# EasyEDA Pro project Modular End Effector.eprj

# Schematic Schematic1
Board Name: MainBoard; Create Date: 2026-03-02; Page Name: P1; Project Name: Modular End Effector; Schematic Name: Schematic1; Update Date: 2026-03-23; Company: EasyEDA.com; Page Size: A4; Version: V1.0
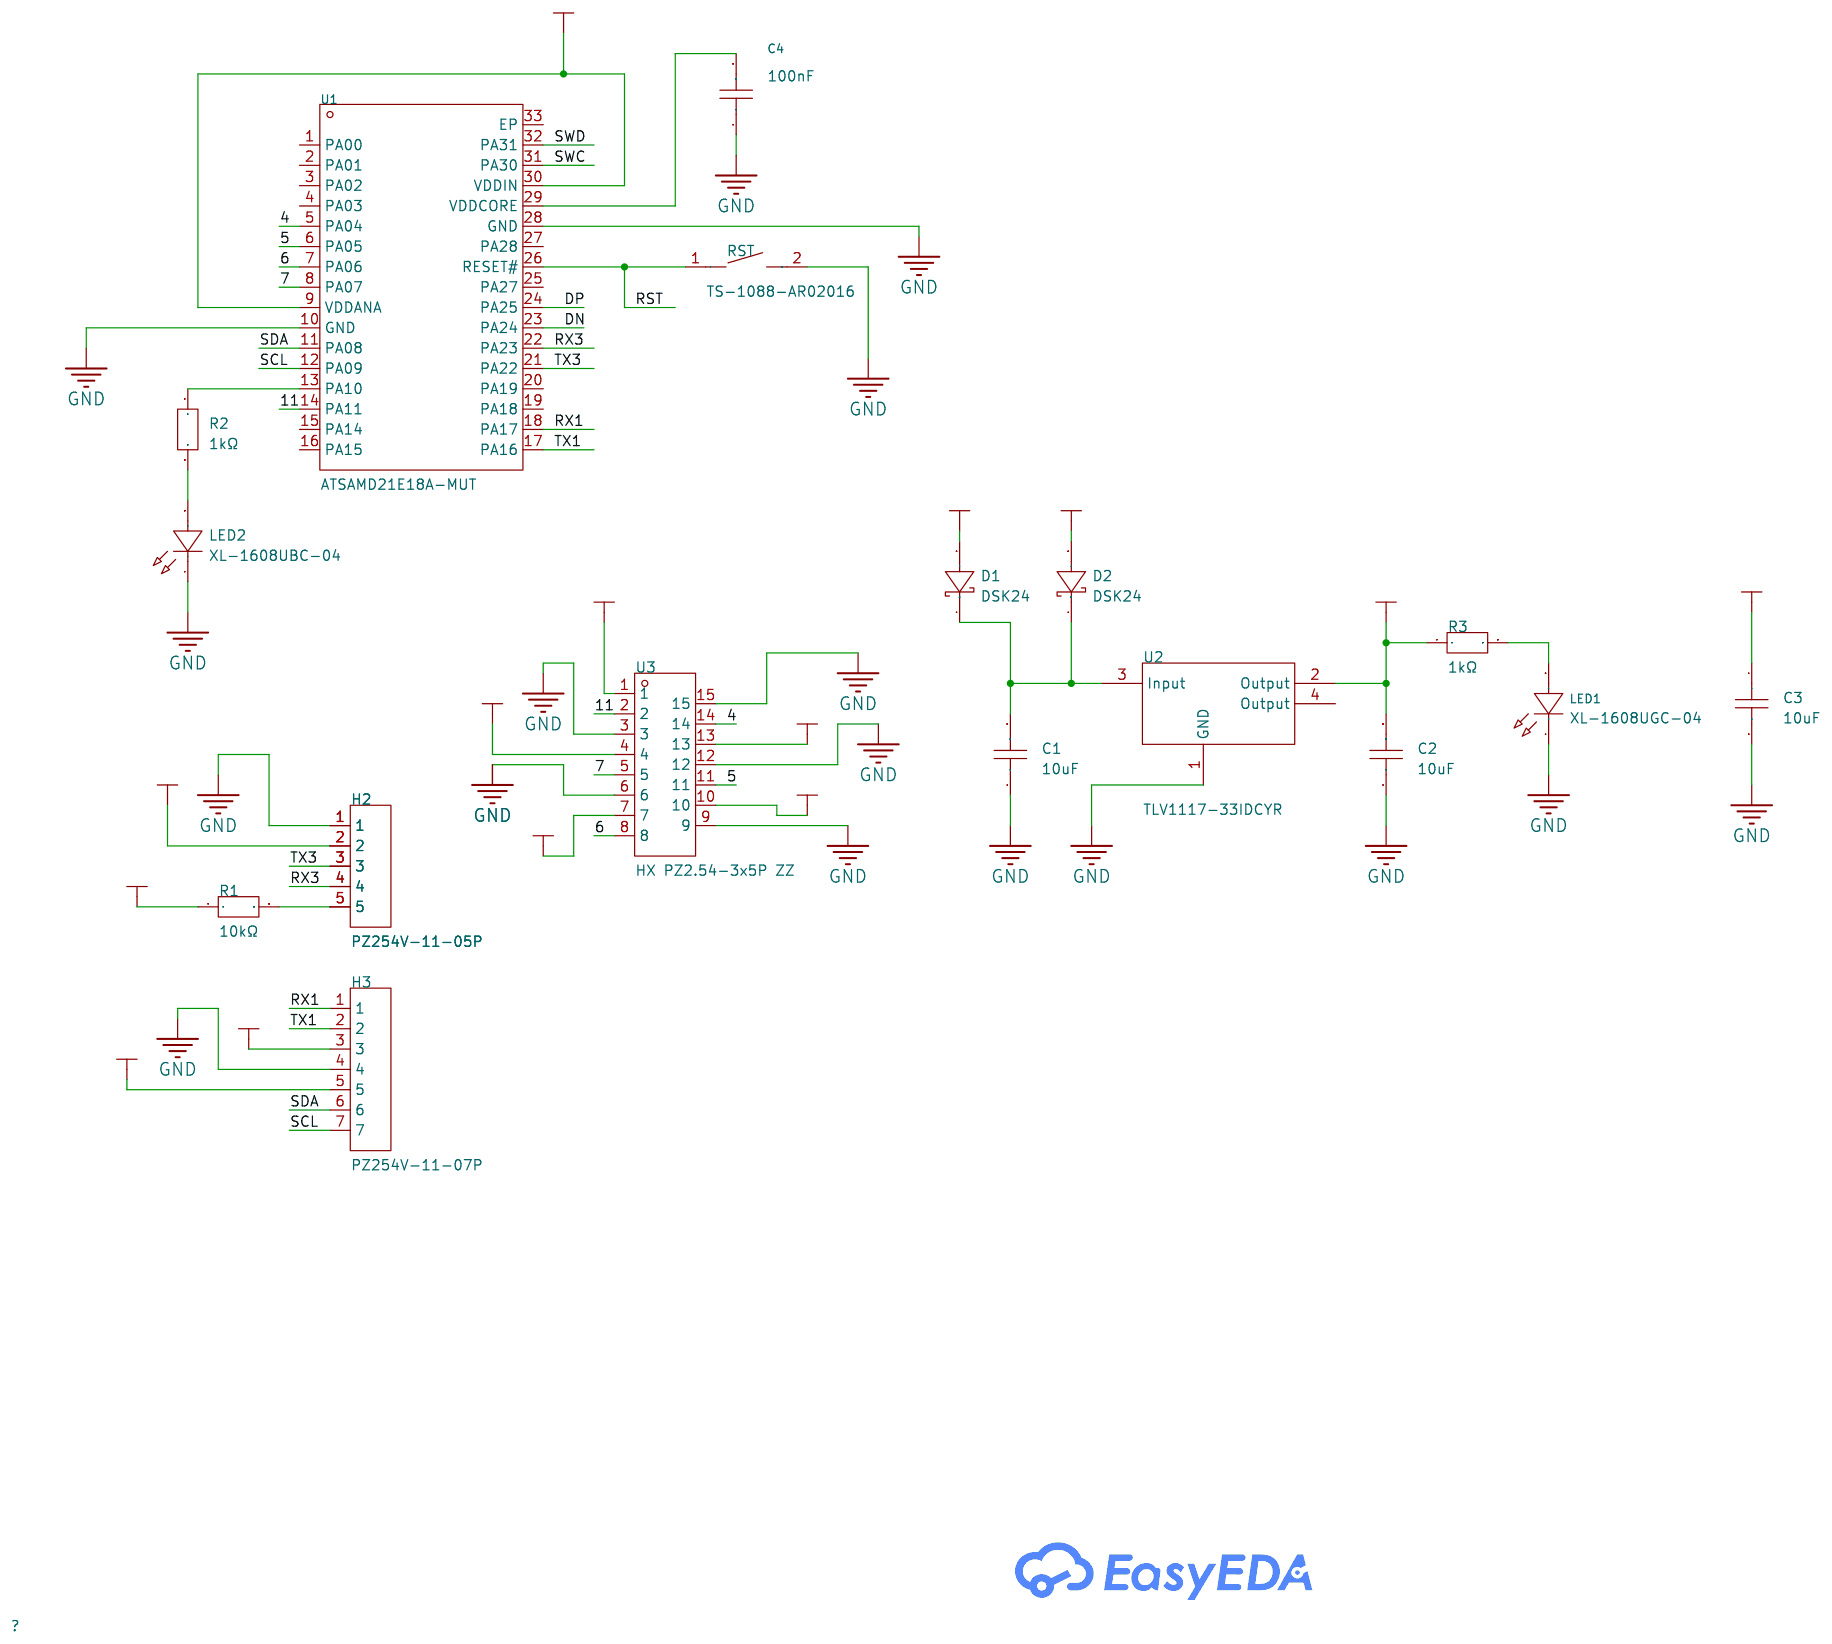
[diagram p0: schematic sheet]

## Parts
C1  10uF  [C0805]
C2  10uF  [C0805]
C3  10uF  [C0805]
C4  100nF  [C0402]
D1  DSK24  [SOD-123FL_L2.7-W1.8-LS3.8-RD]
D2  DSK24  [SOD-123FL_L2.7-W1.8-LS3.8-RD]
H2  PZ254V-11-05P  [HDR-TH_5P-P2.54-V-M]  (no BOM)
H3  PZ254V-11-07P  [HDR-TH_7P-P2.54-V-M]  (no BOM)
LED1  XL-1608UGC-04  [LED0603-RD_GREEN]
LED2  XL-1608UBC-04  [LED0603-RD_BLUE]
R1  10kΩ  [R0402]
R2  1kΩ  [R0402]
R3  1kΩ  [R0402]
RST  TS-1088-AR02016  [SW-SMD_L3.9-W3.0-P4.45]
U1  ATSAMD21E18A-MUT  [QFN-32_L5.0-W5.0-P0.50-TL-EP3.6]
U2  TLV1117-33IDCYR  [SOT-223-4_L6.5-W3.5-P2.30-LS7.0-BR]
U3  HX PZ2.54-3x5P ZZ  [HDR-TH_15P-P2.54-V-M-R3-C5-S7.5]  (no BOM)

## Library data of the parts
C1 = CGA0805X5R106K160MT: LCSC Part Name: 10uF ±10% 16V; Supplier Part: C6119886; Manufacturer: HRE(芯声); Supplier Footprint: 0805; JLCPCB Part Class: Extended Part; Datasheet: https://item.szlcsc.com/datasheet/CGA0805X5R106K160MT/7062592.html; Supplier: LCSC; Tolerance: ±10%; Voltage Rating: 16V; Temperature Coefficient: X5R
C2 C3 = CS2012X7R106M100NRE: LCSC Part Name: 10uF ±20% 10V; Supplier Part: C5189822; Manufacturer: SAMWHA(三和); Supplier Footprint: 0805; JLCPCB Part Class: Extended Part; Datasheet: https://item.szlcsc.com/datasheet/CS2012X7R106M100NRE/5869643.html; Supplier: LCSC; Tolerance: ±20%; Voltage Rating: 10V; Temperature Coefficient: X7R
C4 = CC0402KRX7R6BB104: LCSC Part Name: 100nF ±10% 10V; Supplier Part: C309458; Manufacturer: YAGEO(国巨); Supplier Footprint: 0402; JLCPCB Part Class: Extended Part; Datasheet: https://item.szlcsc.com/datasheet/CC0402KRX7R6BB104/293074.html; Supplier: LCSC; Tolerance: ±10%; Voltage Rating: 10V; Temperature Coefficient: X7R
D1 D2 = DSK24_C908229: LCSC Part Name: 电压:40V 电流:2A; Supplier Part: C908229; Manufacturer: FUXINSEMI(富芯森美); Supplier Footprint: SOD-123; JLCPCB Part Class: Extended Part; Datasheet: https://atta.szlcsc.com/upload/public/pdf/source/20201027/C908229_4A8ECB1BD88877D27DF9B2F604A33773.pdf; Supplier: LCSC; Forward Voltage (Vf@If): 550mV@2A; Reverse Voltage (Vr): 40V; Rectified Current: 2A; Reverse Leakage Current (Ir): 500uA
H2 = PZ254V-11-05P: LCSC Part Name: 1x5P 间距:2.54mm 方针 直插; Supplier Part: C492404; Manufacturer: XFCN(兴飞); Supplier Footprint: 插件,P=2.54mm; JLCPCB Part Class: Extended Part; Datasheet: https://item.szlcsc.com/datasheet/PZ254V-11-05P/502960.html; Supplier: LCSC; Pin Structure: 1x5P; Pitch: 2.54mm; Circluar Pins/Square Pins: Pin Header; Mounting Type: Through Hole; Number of Rows: 1; Number of Pins: 5P; Current Rating: 3A; Voltage Rating (Max): 250V; Length of Mating Pin: 6mm; Insulation Height: 2.5mm; Length of End Connection Pin: 3mm; Contact Material: Brass; Operating Temperature: -40℃~+105℃; Color: Black
H3 = PZ254V-11-07P: LCSC Part Name: 1x7P 间距:2.54mm 方针 直插; Supplier Part: C492406; Manufacturer: XFCN(兴飞); Supplier Footprint: 插件,P=2.54mm; JLCPCB Part Class: Extended Part; Datasheet: https://item.szlcsc.com/datasheet/PZ254V-11-07P/502962.html; Supplier: LCSC; Pin Structure: 1x7P; Pitch: 2.54mm; Circluar Pins/Square Pins: Pin Header; Mounting Type: Through Hole; Number of Rows: 1; Number of Pins: 7P; Current Rating: 3A; Voltage Rating (Max): 250V; Length of Mating Pin: 6mm; Insulation Height: 2.5mm; Length of End Connection Pin: 3mm; Contact Material: Brass; Operating Temperature: -40℃~+105℃; Color: Black
LED1 = XL-1608UGC-04: LCSC Part Name: 0603翠绿贴片式发光二极管; Supplier Part: C965804; Manufacturer: XINGLIGHT(成兴光); Supplier Footprint: 0603; JLCPCB Part Class: Extended Part; Datasheet: https://item.szlcsc.com/datasheet/XL-1608UGC-04/1051413.html; Supplier: LCSC; Illumination Color: Emerald Green; Voltage - Forward(Vf): 3.3V; Power(Watts): 70mW; Forward Current: 20mA; Wavelength - Dominant: 515nm~535nm; Peak Wavelength: 525nm; Diode Configuration: Discrete Diode; Lens Color: Water Clear; Luminous Intensity: 810mcd; Viewing Angle: 120°; Mounting Style: Top-mount; Operating Temperature: -40℃~+85℃
LED2 = XL-1608UBC-04: LCSC Part Name: 0603蓝色贴片式发光二极管; Supplier Part: C965807; Manufacturer: XINGLIGHT(成兴光); Supplier Footprint: 0603; JLCPCB Part Class: Extended Part; Datasheet: https://item.szlcsc.com/datasheet/XL-1608UBC-04/1051416.html; Supplier: LCSC; Illumination Color: Blue; Voltage - Forward(Vf): 3.3V; Power(Watts): 70mW; Forward Current: 20mA; Wavelength - Dominant: 455nm~475nm; Peak Wavelength: 470nm; Lens Color: Water Clear; Luminous Intensity: 300mcd; Viewing Angle: 120°; Mounting Style: op View Mount
R1 = FRC0402J103 TS: LCSC Part Name: 10kΩ ±5% 62.5mW 厚膜电阻; Supplier Part: C2906885; Manufacturer: FOJAN(富捷); Supplier Footprint: 0402; JLCPCB Part Class: Extended Part; Supplier: LCSC; Type: Thick Film Resistor; Tolerance: ±5%; Power(Watts): 62.5mW; Voltage-Supply(Max): 50V; Temperature Coefficient: ±100ppm/℃; Operating Temperature: -55℃~+155℃
R2 R3 = FRC0402F1001TS: LCSC Part Name: 1kΩ ±1% 62.5mW 厚膜电阻; Supplier Part: C2906864; Manufacturer: FOJAN(富捷); Supplier Footprint: 0402; JLCPCB Part Class: Extended Part; Supplier: LCSC; Type: Thick Film Resistor; Tolerance: ±1%; Power(Watts): 62.5mW; Voltage-Supply(Max): 50V; Temperature Coefficient: ±100ppm/℃; Operating Temperature: -55℃~+155℃
RST = TS-1088-AR02016: LCSC Part Name: 4*3*2mm 立贴 轻触开关; Supplier Part: C720477; Manufacturer: XUNPU(讯普); Supplier Footprint: SMD,4x3mm; JLCPCB Part Class: Basic Part; Datasheet: https://item.szlcsc.com/datasheet/TS-1088-AR02016/763484.html; Supplier: LCSC; Circuit: SPST; Actuator Style: Round Button; Operating Force: 1.6N; Mounting Type: Surface Mount,Vertical; Length: 4mm; Width: 3mm; Switch Height: 2mm; with Bracket: Without Bracket; Contact Current: 50mA; Voltage Rating: 12V; Actuator/Cap Color: Black; Termination Style: SMD(SMT) Tab; Life: 100,000 Cycles; Operating Temperature: -30℃~+80℃
U1 = ATSAMD21E18A-MUT: LCSC Part Name: 低功耗、带先进模拟电路和PWM的32位Cortex-M0+微控制器; Supplier Part: C2052801; Manufacturer: MICROCHIP(美国微芯); Supplier Footprint: QFN-32-EP(5x5); JLCPCB Part Class: Extended Part; Datasheet: https://item.szlcsc.com/datasheet/ATSAMD21E18A-MUT/2144370.html; Supplier: LCSC; CPU Core: ARM Cortex-M0+; CPU Maximum Speed: 48MHz; Core Size: 32 Bit; Program Storage Size: 256KB; Program Memory Type: FLASH; RAM Size: 32KB; Number of I/O: 26; ADC (Bit): 12bit; DAC (Bit): 10bit; Oscillator Type: Built-in; Voltage - Supply: 1.62V~3.6V; Operating Temperature: -40℃~+85℃
U2 = TLV1117-33IDCYR_C37359: LCSC Part Name: 800mA 15V 线性稳压器; Supplier Part: C37359; Manufacturer: TI(德州仪器); Supplier Footprint: SOT-223-4; JLCPCB Part Class: Extended Part; Datasheet: https://www.ti.com/cn/lit/gpn/tlv1117; Supplier: LCSC; Output Type: Fixed; Maximum Input Voltage: 15V; Output Voltage: 3.3V; Output Current: 800mA; Power Supply Rejection Ratio (PSRR): 75dB@(120Hz); Dropout Voltage: 1.3V@(800mA); Feature: ESD Protection；Overcurrent Protection(OCP)；With ability; Operating Temperature: -40℃~+125℃; Output Polarity: Positive electrode; Number of Outputs: 1
U3 = HX PZ2.54-3x5P ZZ: LCSC Part Name: 3x5P 间距:2.54mm 方针 直插; Supplier Part: C32713292; Manufacturer: hanxia(韩下); Supplier Footprint: 插件,P=2.54mm; JLCPCB Part Class: Extended Part; Datasheet: https://item.szlcsc.com/datasheet/HX%2520PZ2.54-3x5P%2520ZZ/34444572.html; Supplier: LCSC; Pin Structure: 3x5P; Pitch: 2.54mm; Row Spacing: 2.54mm; Circluar Pins/Square Pins: Pin Header; Mounting Type: Through Hole; Number of Rows: 3; Number of Pins: 15P; Current Rating: 3A; Voltage Rating (Max): 1kV; Length of Mating Pin: 6mm; Insulation Height: 2.5mm; Length of End Connection Pin: 3mm; Contact Material: Brass; Contact Plating: Gold; Operating Temperature: -40℃~+105℃; Color: Black

## Nets
+3.3V: C2.2 C3.1 H3.5 R1.1 R3.1 U1.9(VDDANA) U1.30(VDDIN) U2.2(Output)
+7.4V: D1.2(A) H2.2 H3.3 U3.1 U3.4 U3.7 U3.10 U3.13
GND: C1.1 C2.1 C3.2 C4.1 H2.1 H3.4 LED1.1(K) LED2.1(K) RST.2 U1.10(GND) U1.28(GND) U2.1(GND) U3.3 U3.6 U3.9 U3.12 U3.15
VBUS: D2.2(A)
4: U1.5(PA04) U3.14
5: U1.6(PA05) U3.11
6: U1.7(PA06) U3.8
7: U1.8(PA07) U3.5
11: U1.14(PA11) U3.2
DN: U1.23(PA24)
DP: U1.24(PA25)
RST: RST.1 U1.26(RESET#)
RX1: H3.1 U1.18(PA17)
RX3: H2.4 U1.22(PA23)
SCL: H3.7 U1.12(PA09)
SDA: H3.6 U1.11(PA08)
SWC: U1.31(PA30)
SWD: U1.32(PA31)
TX1: H3.2 U1.17(PA16)
TX3: H2.3 U1.21(PA22)
$1N1936: C1.2 D1.1(C) D2.1(C) U2.3(Input)
$1N2134: C4.2 U1.29(VDDCORE)
$1N2737: H2.5 R1.2
$1N3455: R2.1 U1.13(PA10)
Net-(LED1-2): LED1.2(A) R3.2
Net-(LED2-2): LED2.2(A) R2.2

Not connected (* = marked no-connect by the designer): U1 1(PA00) 2(PA01) 3(PA02) 4(PA03) 15(PA14) 16(PA15) 19(PA18) 20(PA19) 25(PA27) 27(PA28) 33(EP); U2 4(Output)

# Schematic Schematic2
Board Name: PogoBoard; Create Date: 2026-03-04; Page Name: P1; Project Name: Modular End Effector; Schematic Name: Schematic2; Update Date: 2026-03-04; Company: EasyEDA.com; Page Size: A4; Version: V1.0
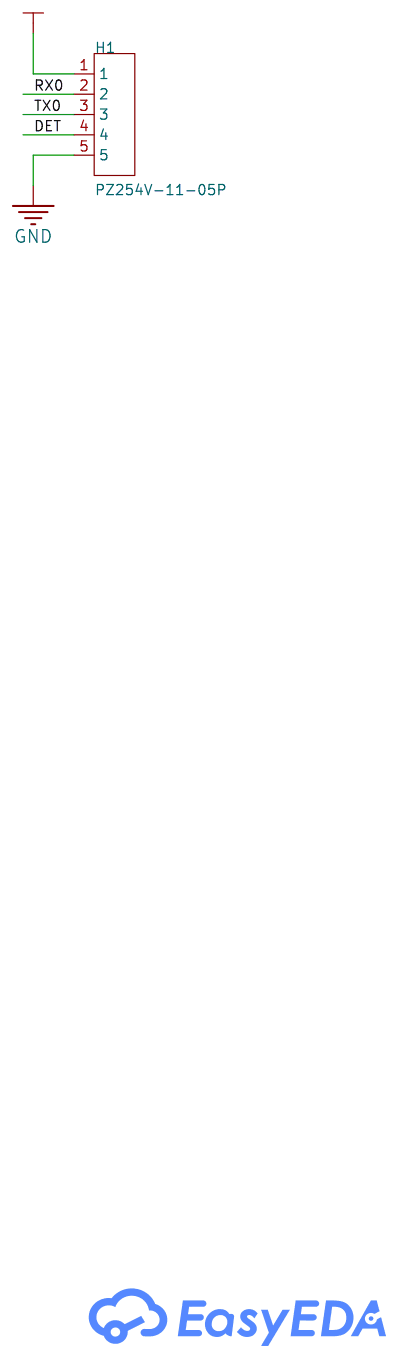
[diagram p1: schematic sheet]

## Parts
H1  PZ254V-11-05P  [HDR-TH_5P-P2.54-V-M]  (no BOM)

## Library data of the parts
H1 = PZ254V-11-05P: LCSC Part Name: 1x5P 间距:2.54mm 方针 直插; Supplier Part: C492404; Manufacturer: XFCN(兴飞); Supplier Footprint: 插件,P=2.54mm; JLCPCB Part Class: Extended Part; Datasheet: https://item.szlcsc.com/datasheet/PZ254V-11-05P/502960.html; Supplier: LCSC; Pin Structure: 1x5P; Pitch: 2.54mm; Circluar Pins/Square Pins: Pin Header; Mounting Type: Through Hole; Number of Rows: 1; Number of Pins: 5P; Current Rating: 3A; Voltage Rating (Max): 250V; Length of Mating Pin: 6mm; Insulation Height: 2.5mm; Length of End Connection Pin: 3mm; Contact Material: Brass; Operating Temperature: -40℃~+105℃; Color: Black

## Nets
+7.4V: H1.1
GND: H1.5
DET: H1.4
RX0: H1.2
TX0: H1.3

# Schematic Schematic3
Board Name: FlashingBoard; Create Date: 2026-03-26; Page Name: P1; Project Name: Modular End Effector; Schematic Name: Schematic3; Update Date: 2026-03-26; Company: EasyEDA.com; Page Size: A4; Version: V1.0
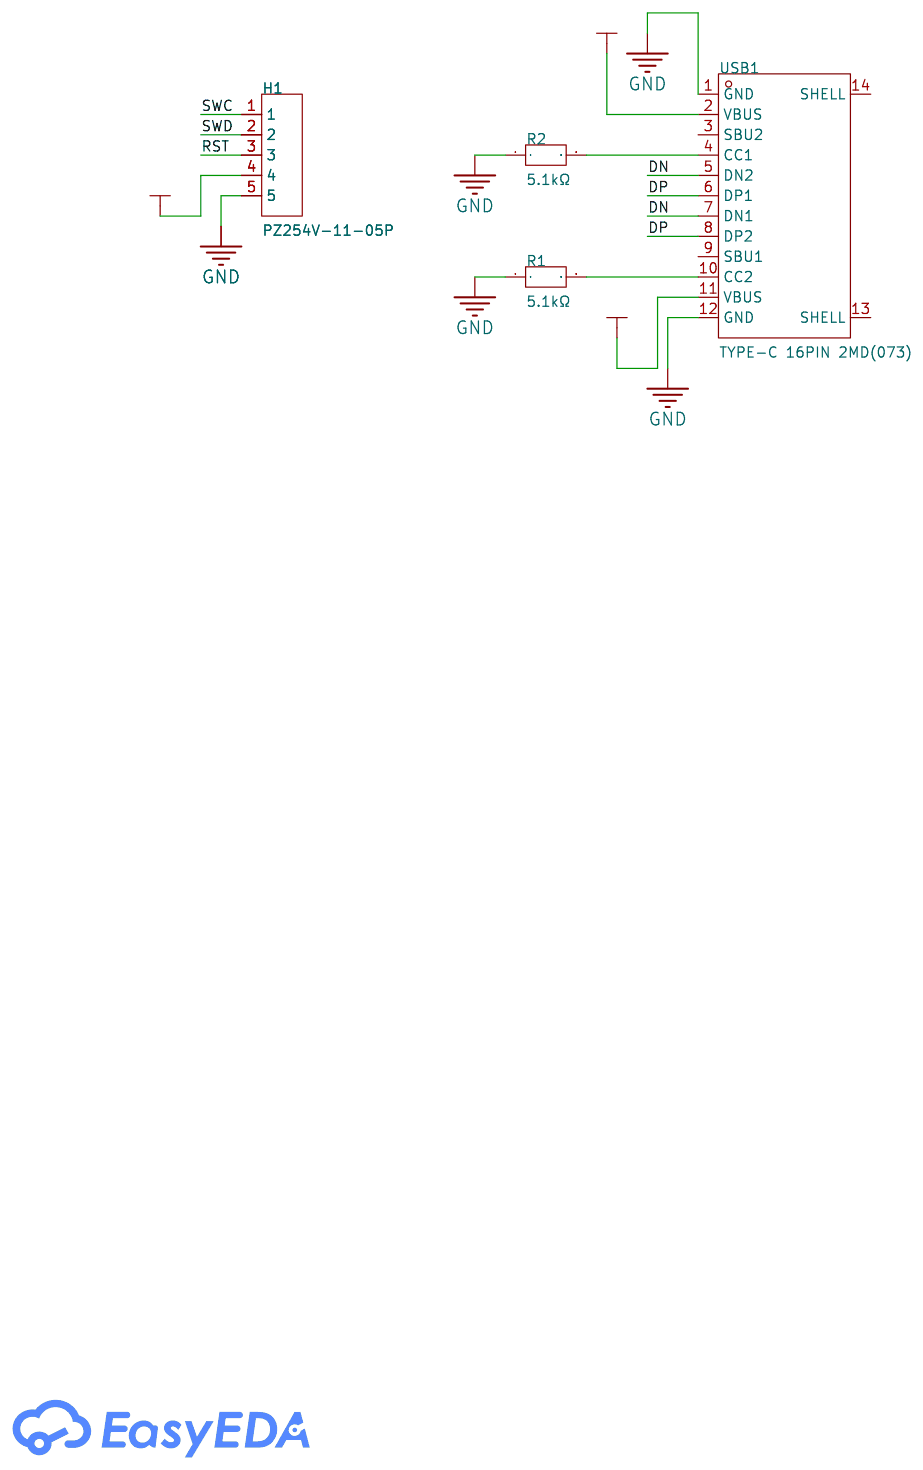
[diagram p2: schematic sheet]

## Parts
H1  PZ254V-11-05P  [HDR-TH_5P-P2.54-V-M]  (no BOM)
R1  5.1kΩ  [R0402]
R2  5.1kΩ  [R0402]
USB1  TYPE-C 16PIN 2MD(073)  [USB-C-SMD_TYPE-C-6PIN-2MD-073]

## Library data of the parts
H1 = PZ254V-11-05P: LCSC Part Name: 1x5P 间距:2.54mm 方针 直插; Supplier Part: C492404; Manufacturer: XFCN(兴飞); Supplier Footprint: 插件,P=2.54mm; JLCPCB Part Class: Extended Part; Datasheet: https://item.szlcsc.com/datasheet/PZ254V-11-05P/502960.html; Supplier: LCSC; Pin Structure: 1x5P; Pitch: 2.54mm; Circluar Pins/Square Pins: Pin Header; Mounting Type: Through Hole; Number of Rows: 1; Number of Pins: 5P; Current Rating: 3A; Voltage Rating (Max): 250V; Length of Mating Pin: 6mm; Insulation Height: 2.5mm; Length of End Connection Pin: 3mm; Contact Material: Brass; Operating Temperature: -40℃~+105℃; Color: Black
R1 R2 = FRC0402F5101TS: LCSC Part Name: 5.1kΩ ±1% 62.5mW 厚膜电阻; Supplier Part: C2906874; Manufacturer: FOJAN(富捷); Supplier Footprint: 0402; JLCPCB Part Class: Extended Part; Supplier: LCSC; Type: Thick Film Resistor; Tolerance: ±1%; Power(Watts): 62.5mW; Voltage-Supply(Max): 50V; Temperature Coefficient: ±100ppm/℃; Operating Temperature: -55℃~+155℃
USB1 = TYPE-C 16PIN 2MD(073): LCSC Part Name: 16P卧贴母座; Supplier Part: C2765186; Manufacturer: SHOU HAN(首韩); Supplier Footprint: SMD; JLCPCB Part Class: Extended Part; Datasheet: https://item.szlcsc.com/datasheet/TYPE-C%252016PIN%25202MD(073)/2901843.html; Supplier: LCSC; Connector Type: Type-C; Gender: Female; Mounting Type: Surface Mount, Right Angle; Number of Contacts: 16P; Number of Ports: 1; Current Rating-Power: 3A; Voltage Rating: 5V; Connect-Disconnect Life: 5,000 times; Detection color: Black; Operating Temperature: -25℃~+85℃

## Nets
+3.3V: H1.4
GND: H1.5 R1.1 R2.1 USB1.1(GND) USB1.12(GND)
VBUS: USB1.2(VBUS) USB1.11(VBUS)
DN: USB1.5(DN2) USB1.7(DN1)
DP: USB1.6(DP1) USB1.8(DP2)
RST: H1.3
SWC: H1.1
SWD: H1.2
$1N451: R2.2 USB1.4(CC1)
$1N455: R1.2 USB1.10(CC2)

Not connected (* = marked no-connect by the designer): USB1 3(SBU2) 9(SBU1) 13(SHELL) 14(SHELL)

# Board PCB1
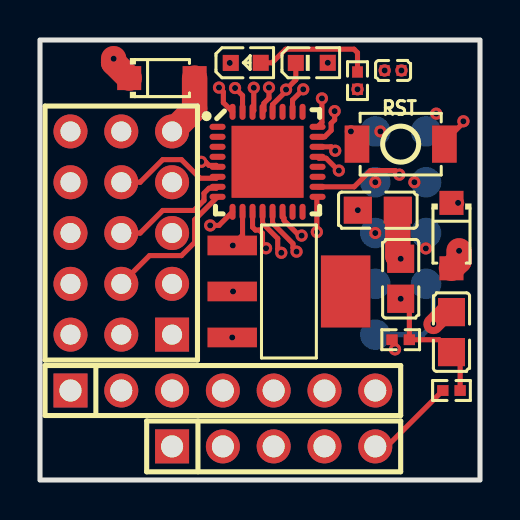
[diagram p3: board, top side]
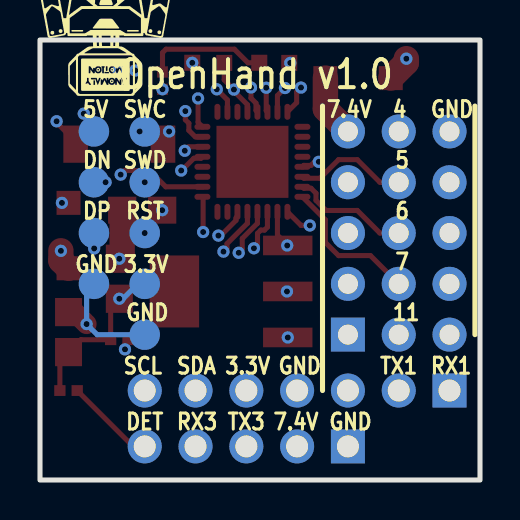
[diagram p4: board, bottom side, seen from below]

Outline 22 x 22 mm; copper layers: Top Layer, Inner1, Inner2, Inner3, Inner4, Bottom Layer. Coordinates in mm from the lower left corner of the outline.
Outline path: rectangle 0,22 22,0
Stack: Top Layer 0.035mm Outer layer thickness 1oz / Dielectric1 0.0994mm 3313 RC57% 4.2mil / Inner1 0.0152mm Inner layer thickness / Dielectric2 0.55mm 0.55mm H/H No copper / Inner2 0.0152mm Inner layer thickness / Dielectric3 0.1088mm 2116 RC54% 4.9mil / Inner3 0.0152mm Inner layer thickness / Dielectric4 0.55mm 0.55mm H/H No copper / Inner4 0.0152mm Inner layer thickness / Dielectric5 0.0994mm 3313 RC57% 4.2mil / Bottom Layer 0.035mm Outer layer thickness 1oz

## Design rules (mm)
template: Custom Config
spacing copperThickness1oz (default): track to track 0.102, other pairs 0.152 to 0.3
spacing copperThickness2oz: track to track 0.203, other pairs 0.152 to 0.3
track width copperThickness1oz (default): min 0.127, default 0.254, max 2.54
track width copperThickness2oz: min 0.203, default 0.254, max 2.54
differential pair differentialPair (default): width min 0.127, default 0.254, max 2.54; gap min 0.152, default 0.152
via viaSize (default): diameter min 0.5, default 0.61, max 10; hole min 0.3, default 0.305, max 6.3

## Placement (name value [footprint] x y rotation side)
C1  10uF  [C0805]  16.89 13.49 180 top
C2  10uF  [C0805]  18.03 10.06 270 top
C3  10uF  [C0805]  20.57 7.39 90 top
C4  100nF  [C0402]  17.65 20.48 0 top
D1  DSK24  [SOD-123FL_L2.7-W1.8-LS3.8-RD]  6.1 20.09 0 top
D2  DSK24  [SOD-123FL_L2.7-W1.8-LS3.8-RD]  20.57 12.22 270 top
H2  PZ254V-11-05P  [HDR-TH_5P-P2.54-V-M]  11.68 1.68 0 top
H3  PZ254V-11-07P  [HDR-TH_7P-P2.54-V-M]  9.14 4.47 0 top
NOREF  -  [Pad_e8208]  16.76 12.35 0 top
NOREF#2  -  [Pad_e8213]  16.76 9.81 0 top
NOREF#3  -  [Pad_e8214]  16.76 7.27 0 top
NOREF#4  -  [Pad_e8199]  19.3 14.89 0 top
NOREF#5  -  [Pad_e8205]  19.3 12.35 0 top
NOREF#6  -  [Pad_e8209]  19.3 9.81 0 top
NOREF#7  -  [Pad_e8201]  16.76 17.43 0 top
NOREF#8  -  [Pad_e8197]  19.3 17.43 0 top
NOREF#9  -  [Pad_e8202]  16.76 14.89 0 top
PA10  XL-1608UBC-04  [LED0603-RD_BLUE]  10.29 20.86 0 top
PWR  XL-1608UGC-04  [LED0603-RD_GREEN]  13.59 20.86 0 top
R1  10kΩ  [R0402]  20.57 4.47 180 top
R2  1kΩ  [R0402]  15.88 19.97 90 top
R3  1kΩ  [R0402]  18.03 7.01 180 top
RST  TS-1088-AR02016  [SW-SMD_L3.9-W3.0-P4.45]  18.03 16.79 0 top
U1  ATSAMD21E18A-MUT  [QFN-32_L5.0-W5.0-P0.50-TL-EP3.6]  11.38 15.91 0 top
U2  TLV1117-33IDCYR  [SOT-223-4_L6.5-W3.5-P2.30-LS7.0-BR]  12.45 9.43 180 top
U3  HX PZ2.54-3x5P ZZ  [HDR-TH_15P-P2.54-V-M-R3-C5-S7.5]  4.06 12.35 90 top

## Footprints (pads in the part's own frame, mm; a bottom-side part is the same pattern mirrored in y, then rotated)
C0402
  rect 0.5x0.54 smd: 1(-0.42,0) 2(0.42,0)
C0805
  rect 1.41x1.35 smd: 1(-1,0) 2(1,0)
HDR-TH_5P-P2.54-V-M
  rect 1.7x1.7 hole 1.1: 1(-5.08,0)
  round 1.7 hole 1.1: 2(-2.54,0) 3(0,0) 4(2.54,0) 5(5.08,0)
HDR-TH_7P-P2.54-V-M
  rect 1.7x1.7 hole 1.1: 1(-7.62,0)
  round 1.7 hole 1.1: 2(-5.08,0) 3(-2.54,0) 4(0,0) 5(2.54,0) 6(5.08,0) 7(7.62,0)
HDR-TH_15P-P2.54-V-M-R3-C5-S7.5
  rect 1.7x1.7 hole 1: 1(-5.08,-2.54)
  round 1.7 hole 1: 2(-5.08,0) 3(-5.08,2.54) 4(-2.54,-2.54) 5(-2.54,0) 6(-2.54,2.54) 7(0,-2.54) 8(0,0) 9(0,2.54) 10(2.54,-2.54) 11(2.54,0) 12(2.54,2.54) 13(5.08,-2.54) 14(5.08,0) 15(5.08,2.54)
LED0603-RD_BLUE
  rect 0.8x0.8 smd: 1(-0.749,-0.004) 2(0.749,0.004)
LED0603-RD_GREEN
  rect 0.8x0.8 smd: 1(-0.799,-0.004) 2(0.799,0.004)
Pad_e8197
  round 1.524 smd far side: 1(0,0)
Pad_e8199
  round 1.524 smd far side: 1(0,0)
Pad_e8201
  round 1.524 smd far side: 1(0,0)
Pad_e8202
  round 1.524 smd far side: 1(0,0)
Pad_e8205
  round 1.524 smd far side: 1(0,0)
Pad_e8208
  round 1.524 smd far side: 1(0,0)
Pad_e8209
  round 1.524 smd far side: 1(0,0)
Pad_e8213
  round 1.524 smd far side: 1(0,0)
Pad_e8214
  round 1.524 smd far side: 1(0,0)
QFN-32_L5.0-W5.0-P0.50-TL-EP3.6
  oval 0.8x0.299 smd: 1(-2.5,1.75) 2(-2.5,1.25) 3(-2.5,0.75) 4(-2.5,0.25) 5(-2.5,-0.25) 6(-2.5,-0.75) 7(-2.5,-1.25) 8(-2.5,-1.75) 17(2.5,-1.75) 18(2.5,-1.25) 19(2.5,-0.75) 20(2.5,-0.25) 21(2.5,0.25) 22(2.5,0.75) 23(2.5,1.25) 24(2.5,1.75)
  oval 0.3x0.8 smd: 9(-1.75,-2.5) 10(-1.25,-2.5) 11(-0.75,-2.5) 12(-0.25,-2.5) 13(0.25,-2.5) 14(0.75,-2.5) 15(1.25,-2.5) 16(1.75,-2.5) 25(1.75,2.5) 26(1.25,2.5) 27(0.75,2.5) 28(0.25,2.5) 29(-0.25,2.5) 30(-0.75,2.5) 31(-1.25,2.5) 32(-1.75,2.5)
  rect 3.6x3.6 smd: 33(0,0)
R0402
  rect 0.566x0.54 smd: 1(-0.433,0) 2(0.433,0)
SOD-123FL_L2.7-W1.8-LS3.8-RD
  rect 1.2x1.2 smd: 1(-1.635,0) 2(1.635,0)
SOT-223-4_L6.5-W3.5-P2.30-LS7.0-BR
  rect 2.47x0.98 smd: 1(2.835,-2.3) 2(2.835,0) 3(2.835,2.3)
  rect 2.47x3.6 smd: 4(-2.835,0)
SW-SMD_L3.9-W3.0-P4.45
  rect 1.23x1.86 smd: 1(-2.185,0) 2(2.185,0)

## Nets
+3.3V: C2.2 C3.1 H3.5 NOREF#2.1 R1.1 R3.1 U1.9 U1.30 U2.2
+7.4V: D1.2 H2.2 H3.3 U3.1 U3.4 U3.7 U3.10 U3.13
GND: C1.1 C2.1 C3.2 C4.1 H2.1 H3.4 NOREF#3.1 NOREF#6.1 PA10.1 PWR.1 RST.2 U1.10 U1.28 U2.1 U3.3 U3.6 U3.9 U3.12 U3.15
VBUS: D2.2 NOREF#8.1
4: U1.5 U3.14
5: U1.6 U3.11
6: U1.7 U3.8
7: U1.8 U3.5
11: U1.14 U3.2
DN: NOREF#4.1 U1.23
DP: NOREF#5.1 U1.24
RST: NOREF.1 RST.1 U1.26
RX1: H3.1 U1.18
RX3: H2.4 U1.22
SCL: H3.7 U1.12
SDA: H3.6 U1.11
SWC: NOREF#7.1 U1.31
SWD: NOREF#9.1 U1.32
TX1: H3.2 U1.17
TX3: H2.3 U1.21
$1N1936: C1.2 D1.1 D2.1 U2.3
$1N2134: C4.2 U1.29
$1N2737: H2.5 R1.2
$1N3426: PWR.2 R3.2
$1N3455: R2.1 U1.13
$1N3459: PA10.2 R2.2

Pads without a net: U1 1 2 3 4 15 16 19 20 25 27 33; U2 4

## Via types
v1: diameter 0.61, hole 0.305, Top Layer to Bottom Layer, 42 vias

## Routing (per net, layer and track width the routed paths; a pad name or vN(x,y) marks a point on that pad's centre or on a via; arc(x,y) is an arc through that point)
+3.3V: length 40.3
  Top Layer w0.254: v1(18.03,9.06) 18.47,8.63 18.47,7.01 19.96,7.01 C3.1 21.01,5.96 R1.1 ; v1(8.51,12.73) 8.95,12.73 U1.9 ; v1(10.69,19.61) 10.69,18.47 U1.30
  Inner3 w0.254: v1(10.69,19.61) 10.69,14.91 v1(8.51,12.73) ; v1(18.03,9.06) 17.67,9.43 v1(9.65,9.43)
  Inner4 w0.254: v1(8.51,12.73) 9.06,12.18 9.06,11.48 9.65,10.89 v1(9.65,9.43) 9.47,9.61 8.05,9.61 7.87,9.43 7.87,6.63 8.51,6 10.16,6 H3.5
  Bottom Layer w0.254: v1(18.03,9.06) 17.85,9.06 16.97,9.94
+7.4V: length 20.1
  Top Layer w1.27: U3.13 7.73,18.56 D1.2
  Inner4 w1.267: U3.7 U3.10
  Inner4 w1.27: H2.2 9.14,2.16 7.51,3.8 7.51,3.83 6.86,4.47 H3.3 U3.1 U3.4 U3.7 ; U3.10 U3.13
GND: length 15.3
  Top Layer w0.254: U2.1 10.13,12.24 U1.10 ; PWR.1 12.79,20.01 v1(12.3,19.52) 12.3,19.44 11.63,18.77 U1.28 ; 20.09,16.79 21.17,17.87 v1(21.17,17.94)
  Top Layer w1: C3.2 20.27,8.39 v1(19.67,7.8)
  Top Layer w1.27: C1.1 17.89,11.2 v1(18.03,11.06)
  Bottom Layer w0.254: NOREF#3.1 19.14,7.27 v1(19.67,7.8) 19.67,9.44 NOREF#6.1
  vias: v1(9.49,20.85) v1(9.64,11.73) v1(17.23,20.48)
VBUS: length 9.5
  Top Layer w1.27: D2.2 20.96,10.97 v1(20.96,11.46)
  Inner4 w1.27: v1(20.96,11.46) 19.81,12.6 v1(19.81,18.32)
  Bottom Layer w0.254: v1(19.81,18.32) 19.3,17.81 NOREF#8.1
4: length 5.6
  Top Layer w0.254: v1(8.06,15.91) 8.27,15.91 8.45,15.73 8.81,15.73 U1.5
  Inner2 w0.254: v1(8.06,15.91) 7.18,15.91 7.07,16.02 6.14,16.02 6.03,15.91 5.58,15.91 U3.14
5: length 5.7
  Top Layer w0.254: U1.6 8.81,15.09 8,15.09 7.07,16.02 6.14,16.02 5.01,14.89 U3.11
6: length 6
  Top Layer w0.254: U1.7 8.81,14.59 8.45,14.59 8.2,14.34 8.2,13.98 ; U3.8 5.01,12.35 6.14,13.48 7.7,13.48 8.2,13.98
7: length 7.3
  Top Layer w0.254: U1.8 8.88,14.16 7.73,13.01 7.73,11.88 7.07,11.22 5.47,11.22 U3.5
11: length 12.7
  Top Layer w0.254: v1(13.08,12.22) 12.96,12.22 12.2,12.98 12.2,13.1 12.13,13.17 U1.14
  Inner2 w0.254: U3.2 5.47,8.68 7.57,8.68 11.11,12.22 v1(13.08,12.22)
DN: length 8.3
  Top Layer w0.254: v1(14.73,18.44) 14.73,18.01 14.56,17.84 14.56,17.48 14.23,17.16 U1.23
  Inner2 w0.254: v1(14.73,18.44) 16.83,18.44 18.55,16.72 18.55,15.06 v1(18.72,14.89)
DP: length 14.9
  Top Layer w0.254: v1(14.1,19.08) 14.1,17.88 U1.24
  Inner2 w0.254: v1(19.29,11.58) 19.29,14.13 19.66,14.5 19.66,16.62 16.16,20.12 15.14,20.12 v1(14.1,19.08)
  Bottom Layer w0.254: v1(19.29,11.58) 19.3,11.59 NOREF#5.1
RST: length 12.4
  Top Layer w0.254: v1(13.16,19.53) 12.63,19 U1.26
  Inner2 w0.254: v1(15.54,17.43) 13.16,17.43 v1(13.16,19.53)
  Inner3 w0.254: v1(16.76,12.35) 16.49,12.63 15.53,12.63 15.03,13.13 15.03,13.85 15.54,14.37 v1(15.54,17.43)
RX1: length 29.6
  Top Layer w0.254: U1.18 15.71,14.66 16.52,15.47 17.76,15.47 v1(17.97,15.27)
  Inner3 w0.254: v1(17.97,15.27) 16.13,17.11 16.13,17.67 15.79,18.01 15.3,18.01 14.96,17.67 14.72,17.67 7.73,10.68 7.73,9.34 7.07,8.68 5.73,8.68 5.19,8.14 5.19,6.8 4.53,6.14 3.19,6.14 H3.1
RX3: length 23.6
  Top Layer w0.254: U1.22 14.57,16.66 v1(14.76,16.46)
  Inner3 w0.254: H2.4 13.28,1.68 12.15,0.55 11.22,0.55 10.56,1.21 10.56,7.7 9.07,9.19 9.07,10.18 14.22,15.33 14.22,15.93 v1(14.76,16.46)
SCL: length 11.3
  Top Layer w0.254: U1.12 11.13,12.83 11.89,12.07 11.89,11.54 v1(12.06,11.36)
  Inner2 w0.254: H3.7 16.76,6.66 12.59,10.83 12.59,10.83 12.06,11.35 v1(12.06,11.36)
SDA: length 10.7
  Top Layer w0.254: U1.11 10.63,12.64 10.77,12.5 10.96,12.5 11.12,12.33 11.12,11.76 v1(11.3,11.59)
  Inner2 w0.254: v1(11.3,11.59) 11.3,11.3 11.82,10.78 12.11,10.78 14.22,8.67 H3.6
SWC: length 10.2
  Top Layer w0.254: U1.31 10.13,19.22 v1(9.75,19.6)
  Inner2 w0.254: v1(9.75,19.6) 12.3,17.05 15.1,17.05 15.3,16.84 16.81,16.84 17.02,17.05 v1(17.02,17.43)
SWD: length 11.3
  Top Layer w0.254: U1.32 9.17,18.87 9.17,19.4 v1(8.95,19.62)
  Inner2 w0.254: v1(16.76,14.89) 13.64,14.89 9.17,19.36 9.17,19.4 v1(8.95,19.62)
TX1: length 19.3
  Top Layer w0.254: v1(13.84,12.4) 13.84,14.12 U1.17
  Inner2 w0.254: H3.2 4.06,5.67 2.94,6.8 2.94,7.74 3.6,8.4 4.69,8.4 5.47,9.18 5.47,10.28 6.14,10.94 8.02,10.94 9.89,12.81 13.44,12.81 v1(13.84,12.4)
TX3: length 21.4
  Top Layer w0.254: U1.21 13.95,16.09 14.31,16.09 14.92,15.47 v1(14.94,15.47)
  Inner3 w0.254: H2.3 13.09,3.09 13.09,4.94 16.63,8.48 18.28,8.48 18.62,8.82 18.62,9.3 17.35,10.57 16.13,10.57 14.67,12.03 14.67,15.2 v1(14.94,15.47)
$1N1936: length 32.7
  Top Layer w1.27: D1.1 3.68,20.87 v1(3.68,21.06)
  Inner3 w1.27: v1(20.9,13.86) 20.54,13.49 v1(15.89,13.49)
  Inner4 w1.27: 15.26,13.49 v1(15.89,13.49) ; 15.26,13.49 12.86,13.49 5.28,21.06 v1(3.68,21.06) ; 15.26,13.49 15.26,9.07 13.32,7.13 v1(9.61,7.13)
$1N2134: length 9.6
  Top Layer w0.254: U1.29 11.2,18.48 11.2,18.84 11.45,19.09 v1(11.45,19.62)
  Inner2 w0.254: v1(11.45,19.62) 11.58,19.62 13.45,21.49 17.73,21.49 18.07,21.15 v1(18.07,20.48)
$1N2737: length 4.5
  Top Layer w0.254: 20.14,4.47 17.35,1.68 H2.5
$1N3426: length 19.6
  Top Layer w0.254: v1(17.75,6.53) 17.75,6.78 17.6,6.93 R3.2
  Inner2 w0.254: v1(17.75,6.53) 17.75,8.52 17.45,8.82 17.45,9.39 19.05,10.99 19.53,10.99 20.02,11.48 20.02,16.77 15.92,20.86 v1(14.39,20.86)
$1N3455: length 17.3
  Top Layer w0.254: U1.13 11.63,12.84 12.65,11.82 12.65,11.6 v1(12.83,11.42)
  Inner2 w0.254: v1(15.88,19.53) 16.61,18.8 16.98,18.8 19.3,16.47 19.3,14.65 18.96,14.3 15.71,14.3 14.43,13.02 14.43,12.16 13.69,11.42 v1(12.83,11.42)
$1N3459: length 6.2
  Top Layer w0.254: 15.88,20.4 15.88,21.36 15.7,21.54 12.28,21.54 11.6,20.86 PA10.2

## Copper pours and planes (outline as drawn; the poured copper is in the pictures)
GND on Inner1: 18.89,21.62 3.94,21.62 3.81,21.49 3.81,18.7 0.51,18.7 0.51,3.22 3.64,3.22 3.64,0.29 18.88,0.29 18.88,3.55 21.59,3.55 21.61,18.7 18.89,18.7

## Text on the board
Bottom Silkscreen Layer: GND | RX1 | 5 | 6 | 7 | 4 | 11 | TX1 | 7.4V | TX3 | 3.3V | SDA | RX3 | RST | DET | SWC | SWD | SCL | 5V | DN | DP | OpenHand v1.0

# Board PCB2
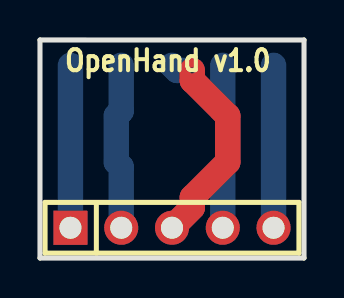
[diagram p5: board, top side]
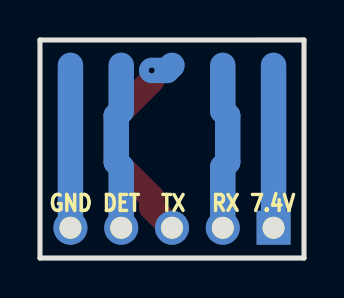
[diagram p6: board, bottom side, seen from below]

Outline 13.21 x 10.91 mm; copper layers: Top Layer, Bottom Layer. Coordinates in mm from the lower left corner of the outline.
Outline path: 0,10.91 13.21,10.91 13.21,0 0,0 0,10.91
Stack: Top Layer 0.035mm / Dielectric1 1.51mm FR4 er 4.5 / Bottom Layer 0.035mm

## Design rules (mm)
template: JLCPCB Capability(Two Layers Board)
spacing copperThickness1oz (default): track to track 0.102, other pairs 0.152 to 0.3
spacing copperThickness2oz: track to track 0.203, other pairs 0.152 to 0.3
track width copperThickness1oz (default): min 0.127, default 0.254, max 2.54
track width copperThickness2oz: min 0.203, default 0.254, max 2.54
differential pair differentialPair (default): width min 0.127, default 0.254, max 2.54; gap min 0.152, default 0.152
via viaSize (default): diameter min 0.5, default 0.61, max 10; hole min 0.3, default 0.305, max 6.3

## Placement (name value [footprint] x y rotation side)
H1  PZ254V-11-05P  [HDR-TH_5P-P2.54-V-M]  6.6 1.51 0 top
NOREF  -  [Pad_e12]  9.14 9.64 0 top
NOREF#2  -  [Pad_e5]  1.52 9.64 0 top
NOREF#3  -  [Pad_e9]  4.06 9.64 0 top
NOREF#4  -  [Pad_e11]  11.68 9.64 0 top
NOREF#5  -  [Pad_e10]  6.6 9.64 0 top

## Footprints (pads in the part's own frame, mm; a bottom-side part is the same pattern mirrored in y, then rotated)
HDR-TH_5P-P2.54-V-M
  rect 1.7x1.7 hole 1.1: 1(-5.08,0)
  round 1.7 hole 1.1: 2(-2.54,0) 3(0,0) 4(2.54,0) 5(5.08,0)
Pad_e5
  round 1.2 smd far side: 1(0,0)
Pad_e9
  round 1.2 smd far side: 1(0,0)
Pad_e10
  round 1.2 smd far side: 1(0,0)
Pad_e11
  round 1.2 smd far side: 1(0,0)
Pad_e12
  round 1.2 smd far side: 1(0,0)

## Nets
+7.4V: H1.1 NOREF#2.1
GND: H1.5 NOREF#4.1
DET: H1.4 NOREF.1
RX0: H1.2 NOREF#3.1
TX0: H1.3 NOREF#5.1

## Via types
v1: diameter 0.61, hole 0.305, Top Layer to Bottom Layer, 1 via

## Routing (per net, layer and track width the routed paths; a pad name or vN(x,y) marks a point on that pad's centre or on a via; arc(x,y) is an arc through that point)
+7.4V: length 8.1
  Bottom Layer w1.27: NOREF#2.1 H1.1
GND: length 8.1
  Bottom Layer w1.27: NOREF#4.1 H1.5
DET: length 8.3
  Bottom Layer w1.27: H1.4 9.14,4.56 9.39,4.8 9.39,7.11 9.14,7.36 NOREF.1
RX0: length 8.3
  Bottom Layer w1.27: H1.2 4.06,4.56 3.82,4.8 3.82,7.11 4.06,7.36 NOREF#3.1
TX0: length 10.9
  Top Layer w1.27: H1.3 7.62,2.53 7.62,3.03 9.39,4.8 9.39,7.11 7.62,8.88 v1(7.62,9.39)
  Bottom Layer w1.27: NOREF#5.1 6.86,9.39 v1(7.62,9.39)

## Text on the board
Bottom Silkscreen Layer: 7.4V | RX | TX | DET | GND
Top Silkscreen Layer: OpenHand v1.0

# Board PCB5
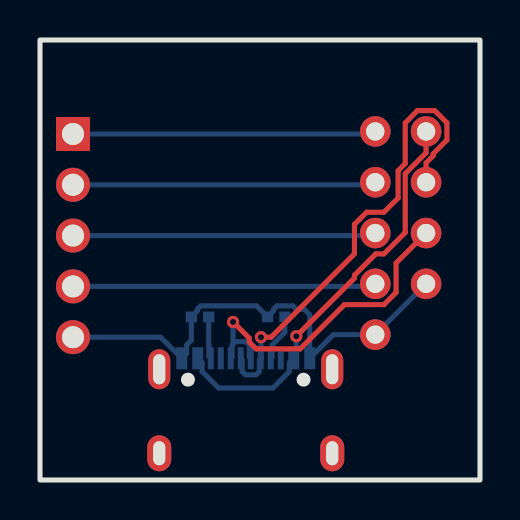
[diagram p7: board, top side]
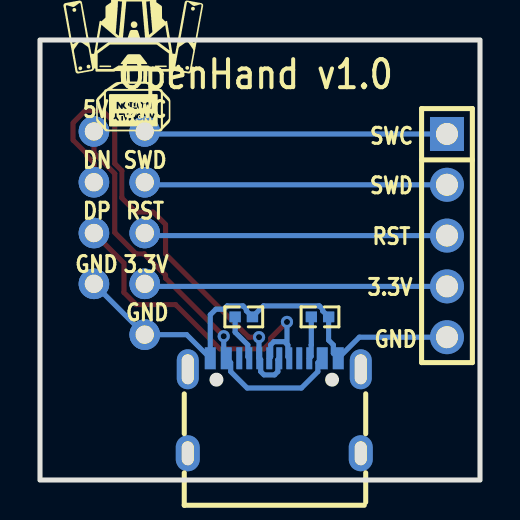
[diagram p8: board, bottom side, seen from below]

Outline 22 x 22 mm; copper layers: Top Layer, Bottom Layer. Coordinates in mm from the lower left corner of the outline.
Outline path: rectangle 0,22 22,0
Stack: Top Layer 0.035mm / Dielectric1 1.51mm FR4 er 4.5 / Bottom Layer 0.035mm

## Design rules (mm)
template: JLCPCB Capability(Two Layers Board)
spacing copperThickness1oz (default): track to track 0.102, other pairs 0.152 to 0.3
spacing copperThickness2oz: track to track 0.203, other pairs 0.152 to 0.3
track width copperThickness1oz (default): min 0.127, default 0.254, max 2.54
track width copperThickness2oz: min 0.203, default 0.254, max 2.54
differential pair differentialPair (default): width min 0.127, default 0.254, max 2.54; gap min 0.152, default 0.152
via viaSize (default): diameter min 0.5, default 0.61, max 10; hole min 0.3, default 0.305, max 6.3

## Placement (name value [footprint] x y rotation side)
H1  PZ254V-11-05P  [HDR-TH_5P-P2.54-V-M]  1.65 12.22 270 bottom
NOREF  -  [Pad_e416]  16.76 9.81 0 top
NOREF#2  -  [Pad_e361]  16.76 12.35 0 top
NOREF#3  -  [Pad_e411]  19.3 17.43 0 top
NOREF#4  -  [Pad_e362]  19.3 12.35 0 top
NOREF#5  -  [Pad_e365]  19.3 17.43 0 top
NOREF#6  -  [Pad_e360]  16.76 14.89 0 top
NOREF#7  -  [Pad_e358]  16.76 9.81 0 top
NOREF#8  -  [Pad_e410]  16.76 17.43 0 top
NOREF#9  -  [Pad_e359]  16.76 17.43 0 top
NOREF#10  -  [Pad_e412]  16.76 14.89 0 top
NOREF#11  -  [Pad_e414]  16.76 12.35 0 top
NOREF#12  -  [Pad_e357]  16.76 7.27 0 top
NOREF#13  -  [Pad_e417]  19.3 9.81 0 top
NOREF#14  -  [Pad_e364]  19.3 14.89 0 top
NOREF#15  -  [Pad_e363]  19.3 9.81 0 top
NOREF#16  -  [Pad_e413]  19.3 14.89 0 top
NOREF#17  -  [Pad_e415]  19.3 12.35 0 top
NOREF#18  -  [Pad_e419]  16.76 7.27 0 top
R1  5.1kΩ  [R0402]  8 8.16 0 bottom
R2  5.1kΩ  [R0402]  11.81 8.16 0 bottom
USB1  TYPE-C 16PIN 2MD(073)  [USB-C-SMD_TYPE-C-6PIN-2MD-073]  10.29 3.71 180 bottom

## Footprints (pads in the part's own frame, mm; a bottom-side part is the same pattern mirrored in y, then rotated)
HDR-TH_5P-P2.54-V-M
  rect 1.7x1.7 hole 1.1: 1(-5.08,0)
  round 1.7 hole 1.1: 2(-2.54,0) 3(0,0) 4(2.54,0) 5(5.08,0)
Pad_e357
  round 1.524 smd far side: 1(0,0)
Pad_e358
  round 1.524 smd far side: 1(0,0)
Pad_e359
  round 1.524 smd far side: 1(0,0)
Pad_e360
  round 1.524 smd far side: 1(0,0)
Pad_e361
  round 1.524 smd far side: 1(0,0)
Pad_e362
  round 1.524 smd far side: 1(0,0)
Pad_e363
  round 1.524 smd far side: 1(0,0)
Pad_e364
  round 1.524 smd far side: 1(0,0)
Pad_e365
  round 1.524 smd far side: 1(0,0)
Pad_e410
  round 1.524 hole 0.914: 1(0,0)
Pad_e411
  round 1.524 hole 0.914: 2(0,0)
Pad_e412
  round 1.524 hole 0.914: 3(0,0)
Pad_e413
  round 1.524 hole 0.914: 4(0,0)
Pad_e414
  round 1.524 hole 0.914: 5(0,0)
Pad_e415
  round 1.524 hole 0.914: 6(0,0)
Pad_e416
  round 1.524 hole 0.914: 7(0,0)
Pad_e417
  round 1.524 hole 0.914: 8(0,0)
Pad_e419
  round 1.524 hole 0.914: 1(0,0)
R0402
  rect 0.566x0.54 smd: 1(-0.433,0) 2(0.433,0)
USB-C-SMD_TYPE-C-6PIN-2MD-073
  rect 0.55x1.1 smd: 1(-3.2,2.375) 2(-2.4,2.375) 11(2.4,2.375) 12(3.2,2.375)
  rect 0.3x1.1 smd: 3(-1.75,2.375) 4(-1.25,2.375) 5(-0.75,2.375) 6(-0.25,2.375) 7(0.25,2.375) 8(0.75,2.375) 9(1.25,2.375) 10(1.75,2.375)
  oval 1.2x1.8 hole 0.6x1.2: 13(-4.325,-2.375) 14(4.325,-2.375)
  oval 1.1x2 hole 0.6x1.5: 13(-4.325,1.825) 14(4.325,1.825)

## Nets
+3.3V: H1.4 NOREF.7 NOREF#7.1
GND: H1.5 NOREF#12.1 NOREF#13.8 NOREF#15.1 NOREF#18.1 R1.1 R2.1 USB1.1 USB1.12
VBUS: NOREF#3.2 NOREF#5.1 USB1.2 USB1.11
DN: NOREF#14.1 NOREF#16.4 USB1.5 USB1.7
DP: NOREF#4.1 NOREF#17.6 USB1.6 USB1.8
RST: H1.3 NOREF#2.1 NOREF#11.5
SWC: H1.1 NOREF#8.1 NOREF#9.1
SWD: H1.2 NOREF#6.1 NOREF#10.3
$1N451: R2.2 USB1.4
$1N455: R1.2 USB1.10

Pads without a net: USB1 3 9 13 14

## Via types
v1: diameter 0.61, hole 0.305, Top Layer to Bottom Layer, 3 vias

## Routing (per net, layer and track width the routed paths; a pad name or vN(x,y) marks a point on that pad's centre or on a via; arc(x,y) is an arc through that point)
+3.3V: length 15.2
  Bottom Layer w0.254: H1.4 16.64,9.68 NOREF.7
GND: length 24.6
  Bottom Layer w0.254: H1.5 6.03,7.14 USB1.12 7.33,6.33 7.33,6.75 7.57,6.99 R1.1 7.87,8.46 7.87,8.54 8.04,8.71 10.83,8.71 R2.1 11.68,8.46 11.68,8.54 11.85,8.71 12.64,8.71 12.81,8.54 13.21,8.54 13.49,8.26 USB1.1 14.67,7.27 NOREF#12.1 NOREF#13.8
VBUS: length 20.9
  Top Layer w0.254: v1(12.81,7.19) 15.72,10.1 15.72,10.24 16.79,11.31 17.19,11.31 18.26,12.38 18.26,15.32 19.3,16.36 NOREF#3.2
  Bottom Layer w0.254: USB1.11 8.11,5.87 8.11,5.42 8.93,4.6 11.65,4.6 12.47,5.42 12.47,5.87 USB1.2 12.81,6.21 v1(12.81,7.19)
DN: length 23.9
  Top Layer w0.254: v1(11.05,7.14) 11.56,7.14 15.72,11.31 15.72,12.78 16.33,13.39 17.19,13.39 17.91,14.1 17.91,15.47 18.26,15.82 18.26,17.86 18.87,18.47 19.73,18.47 20.34,17.86 20.34,17 19.66,16.31 19.66,16.21 19.3,15.86 NOREF#14.1
  Bottom Layer w0.254: USB1.7 10.11,6.02 10.11,5.42 10.27,5.26 10.8,5.26 10.97,5.42 10.97,6.02 USB1.5 11.05,6.1 v1(11.05,7.14)
DP: length 17.1
  Top Layer w0.254: v1(9.65,7.9) 10.47,7.09 10.47,6.9 10.81,6.56 13.01,6.56 15.22,8.77 17.19,8.77 17.8,9.38 17.8,10.85 NOREF#4.1
  Bottom Layer w0.254: USB1.6 10.47,6.16 10.47,6.75 10.3,6.92 9.77,6.92 9.65,6.8 ; 9.65,6.8 9.61,6.75 9.61,6.16 USB1.8 ; 9.65,6.8 v1(9.65,7.9)
RST: length 15.2
  Bottom Layer w0.254: NOREF#2.1 16.64,12.22 H1.3
SWC: length 15.2
  Bottom Layer w0.254: NOREF#8.1 16.64,17.3 H1.1
SWD: length 15.2
  Bottom Layer w0.254: H1.2 16.64,14.76 NOREF#6.1
$1N451: length 2.4
  Bottom Layer w0.254: USB1.4 11.61,6.16 11.61,6.75 12.24,7.39 12.24,8.16
$1N455: length 2.1
  Bottom Layer w0.254: USB1.10 8.44,6.18 8.44,6.75 8.43,6.76 R1.2

## Text on the board
Bottom Silkscreen Layer: GND | RST | SWC | SWD | 3.3V | 5V | DN | DP | OpenHand v1.0
